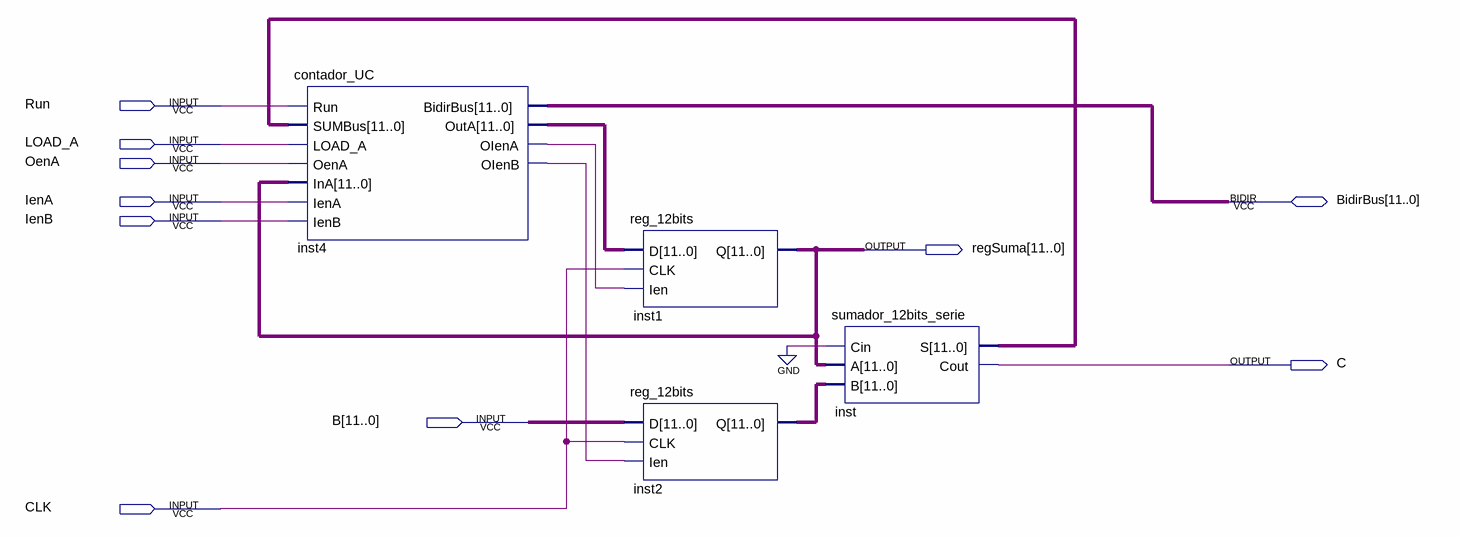
[diagram p0: schematic sheet]
// Quartus schematic contador.bdf as structural Verilog: 4 symbols, 10 pins
module contador (
  input  Run,
  input  LOAD_A,
  input  OenA,
  input  IenA,
  input  IenB,
  input  [11:0] B,
  input  CLK,
  inout  [11:0] BidirBus,
  output [11:0] regSuma,
  output C
);

  wire inst4_oiena, inst4_oienb;
  wire [11:0] inst2_q, inst4_outa, inst_s;

  contador_UC inst4 (
    .Run(Run), .SUMBus(inst_s), .LOAD_A(LOAD_A), .OenA(OenA), .InA(regSuma), .IenA(IenA), .IenB(IenB),
    .OutA(inst4_outa), .OIenA(inst4_oiena), .OIenB(inst4_oienb), .BidirBus(BidirBus));
  reg_12bits inst1 (.D(inst4_outa), .CLK(CLK), .Ien(inst4_oiena), .Q(regSuma));
  reg_12bits inst2 (.D(B), .CLK(CLK), .Ien(inst4_oienb), .Q(inst2_q));
  sumador_12bits_serie inst (.Cin(1'b0), .A(regSuma), .B(inst2_q), .S(inst_s), .Cout(C));
endmodule
